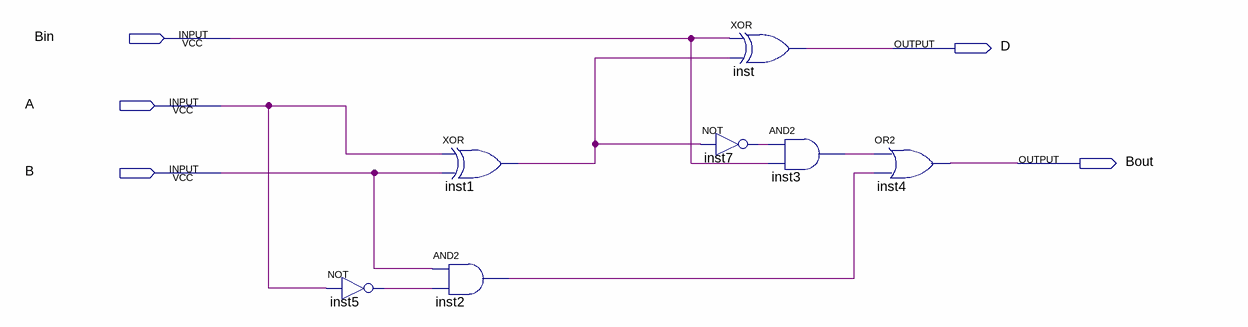
[diagram p0: schematic sheet]
// Quartus schematic fullsubtractor_1b.bdf as structural Verilog: 7 symbols, 5 pins
module fullsubtractor_1b (
  input  Bin,
  input  A,
  input  B,
  output D,
  output Bout
);

  wire inst1_out, inst2_out, inst3_out, inst5_out, inst7_out;

  not inst5 (inst5_out, A);
  xor inst1 (inst1_out, A, B);
  and inst2 (inst2_out, B, inst5_out);
  not inst7 (inst7_out, inst1_out);
  xor inst (D, Bin, inst1_out);
  and inst3 (inst3_out, inst7_out, Bin);
  or inst4 (Bout, inst3_out, inst2_out);
endmodule
